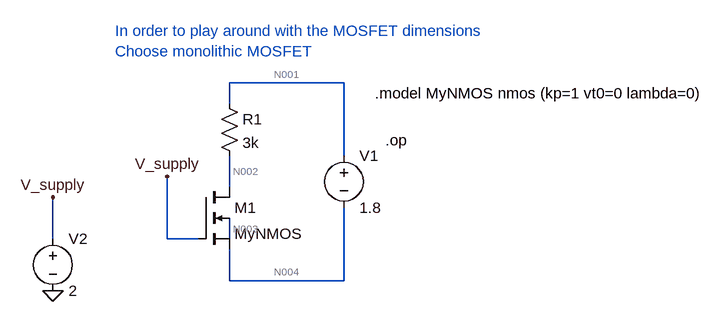
[diagram p0: schematic Draft20.asc]
Draft20.asc, the LTspice schematic file:
Version 4.1
SHEET 1 1004 680
WIRE 352 -80 176 -80
WIRE 176 -48 176 -80
WIRE 352 32 352 -80
WIRE 176 80 176 32
WIRE -96 160 -96 96
WIRE 80 160 80 64
WIRE 128 160 80 160
WIRE 176 160 176 128
WIRE 176 224 176 176
WIRE 352 224 352 112
WIRE 352 224 176 224
FLAG 80 64 V_supply
FLAG -96 240 0
FLAG -96 96 V_supply
SYMBOL nmos4 128 80 R0
SYMATTR InstName M1
SYMATTR Value MyNMOS
SYMATTR Value2 l=1u w=25u
SYMBOL res 160 -64 R0
SYMATTR InstName R1
SYMATTR Value 3k
SYMBOL voltage 352 16 R0
WINDOW 123 0 0 Left 0
WINDOW 39 0 0 Left 0
SYMATTR InstName V1
SYMATTR Value 1.8
SYMBOL voltage -96 144 R0
WINDOW 123 0 0 Left 0
WINDOW 39 0 0 Left 0
SYMATTR InstName V2
SYMATTR Value 2
TEXT 0 -160 Left 2 ;In order to play around with the MOSFET dimensions \nChoose monolithic MOSFET
TEXT 400 -64 Left 2 !.model MyNMOS nmos (kp=1 vt0=0 lambda=0)
TEXT 416 8 Left 2 !.op

The netlist it stands for:
* Draft20.asc
M1 N002 V_supply N004 N003 MyNMOS l=1u w=25u
R1 N001 N002 3k
V1 N001 N004 1.8
V2 V_supply 0 2
.model NMOS NMOS
.model PMOS PMOS
.lib standard.mos
* In order to play around with the MOSFET dimensions
* Choose monolithic MOSFET
.model MyNMOS nmos (kp=1 vt0=0 lambda=0)
.op
.backanno
.end

* Results of the author's LTspice run, read from the files saved beside the schematic
* Operating Point:
*   V(n001) = 848.6 mV
*   V(n002) = -951.4 mV
*   V(n003) = -859.6 mV
*   V(n004) = -951.4 mV
*   V(v_supply) = 2 V
*   I(R1) = 600 µA
*   I(V1) = -600 µA
*   I(V2) = 0 A
*   Ib(M1) = 859.6 fA
*   Id(M1) = 600 µA
*   Ig(M1) = 0 A
*   Is(M1) = -600 µA